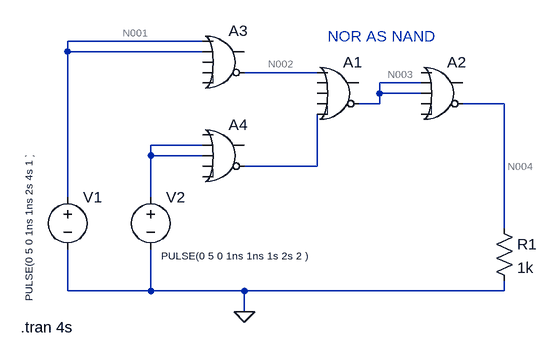
[diagram p0: schematic 210.asc]
210.asc, the LTspice schematic file:
Version 4
SHEET 1 880 680
WIRE 160 -32 -48 -32
WIRE -48 -16 -48 -32
WIRE 160 -16 -48 -16
WIRE 336 16 224 16
WIRE 496 32 432 32
WIRE 432 48 432 32
WIRE 496 48 432 48
WIRE 432 64 432 48
WIRE 432 64 400 64
WIRE 624 64 560 64
WIRE 160 128 80 128
WIRE 80 144 80 128
WIRE 160 144 80 144
WIRE 336 160 336 80
WIRE 336 160 224 160
WIRE -48 208 -48 -16
WIRE 80 208 80 144
WIRE 624 256 624 64
WIRE -48 352 -48 288
WIRE 80 352 80 288
WIRE 80 352 -48 352
WIRE 224 352 80 352
WIRE 624 352 624 336
WIRE 624 352 224 352
WIRE 224 384 224 352
FLAG 224 384 0
SYMBOL Digital\\or 368 -16 R0
SYMATTR InstName A1
SYMBOL Digital\\or 528 -16 R0
SYMATTR InstName A2
SYMBOL res 608 240 R0
SYMATTR InstName R1
SYMATTR Value 1k
SYMBOL voltage -48 192 R0
WINDOW 3 -59 176 VLeft 1
SYMATTR Value PULSE(0 5 0 1ns 1ns 2s 4s 1 )
SYMATTR InstName V1
SYMBOL voltage 80 192 R0
WINDOW 3 16 106 Left 1
SYMATTR Value PULSE(0 5 0 1ns 1ns 1s 2s 2 )
SYMATTR InstName V2
SYMBOL Digital\\or 192 -64 R0
SYMATTR InstName A3
SYMBOL Digital\\or 192 80 R0
SYMATTR InstName A4
TEXT 352 -40 Left 2 ;NOR AS NAND
TEXT -120 408 Left 2 !.tran 4s

The netlist it stands for:
* 210.asc
A1 N002 0 0 0 N006 N003 0 0 OR
A2 0 N003 N003 0 0 N004 0 0 OR
R1 N004 0 1k
V1 N001 0 PULSE(0 5 0 1ns 1ns 2s 4s 1 )
V2 N005 0 PULSE(0 5 0 1ns 1ns 1s 2s 2 )
A3 N001 N001 0 0 0 N002 0 0 OR
A4 0 N005 N005 0 0 N006 0 0 OR
* NOR AS NAND
.tran 4s
.backanno
.end

* Results of the author's LTspice run, read from the files saved beside the schematic
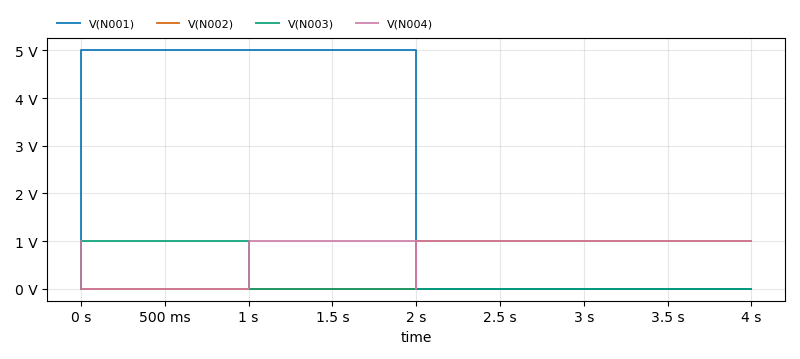
[diagram p1: Transient Analysis of 210.asc, plotted from the saved traces]
* Transient Analysis, 1 run:
*   V(N001): min 0 V, max 5 V, average 2.5 V, rms 3.536 V, last 0 V
*   V(N002): min 0 V, max 1 V, average 500 mV, rms 707.1 mV, last 1 V
*   V(N003): min 0 V, max 1 V, average 250 mV, rms 500 mV, last 0 V
*   V(N004): min 0 V, max 999 mV, average 749.3 mV, rms 865.2 mV, last 999 mV